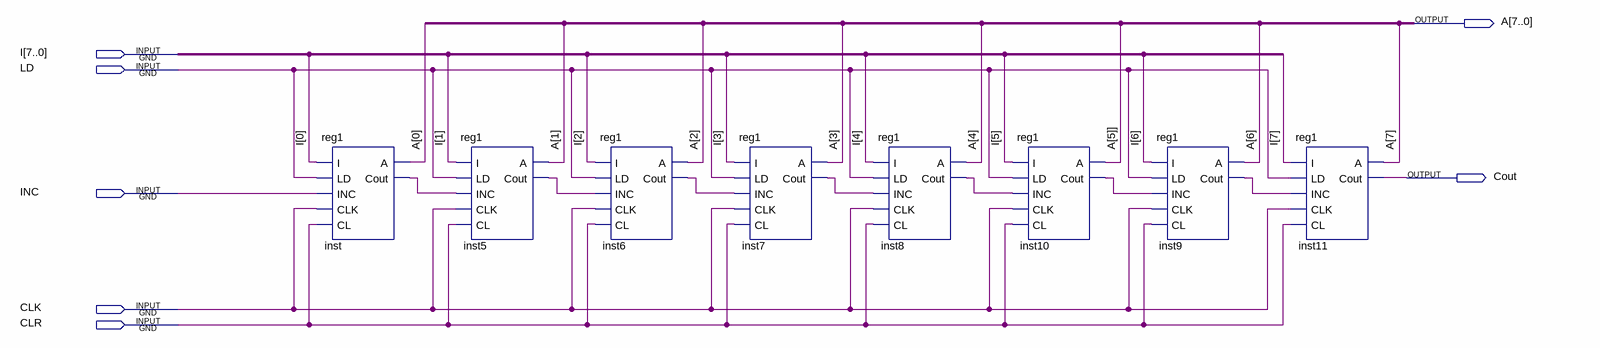
[diagram p0: schematic sheet]
// Quartus schematic reg8_inc_ld_clr.bdf as structural Verilog: 8 symbols, 7 pins
module reg8_inc_ld_clr (
  input  [7:0] I,
  input  LD,
  input  INC,
  input  CLK,
  input  CLR,
  output [7:0] A,
  output Cout
);

  wire \A[5]] , inst5_cout, inst6_cout, inst7_cout, inst8_cout, inst9_cout, inst10_cout, inst_cout;

  reg1 inst (.I(I[0]), .LD(LD), .INC(INC), .CLK(CLK), .CL(CLR), .A(A[0]), .Cout(inst_cout));
  reg1 inst5 (.I(I[1]), .LD(LD), .INC(inst_cout), .CLK(CLK), .CL(CLR), .A(A[1]), .Cout(inst5_cout));
  reg1 inst6 (.I(I[2]), .LD(LD), .INC(inst5_cout), .CLK(CLK), .CL(CLR), .A(A[2]), .Cout(inst6_cout));
  reg1 inst7 (.I(I[3]), .LD(LD), .INC(inst6_cout), .CLK(CLK), .CL(CLR), .A(A[3]), .Cout(inst7_cout));
  reg1 inst8 (.I(I[4]), .LD(LD), .INC(inst7_cout), .CLK(CLK), .CL(CLR), .A(A[4]), .Cout(inst8_cout));
  reg1 inst10 (.I(I[5]), .LD(LD), .INC(inst8_cout), .CLK(CLK), .CL(CLR), .A(\A[5]] ), .Cout(inst10_cout));
  reg1 inst9 (.I(I[6]), .LD(LD), .INC(inst10_cout), .CLK(CLK), .CL(CLR), .A(A[6]), .Cout(inst9_cout));
  reg1 inst11 (.I(I[7]), .LD(LD), .INC(inst9_cout), .CLK(CLK), .CL(CLR), .A(A[7]), .Cout(Cout));
endmodule
